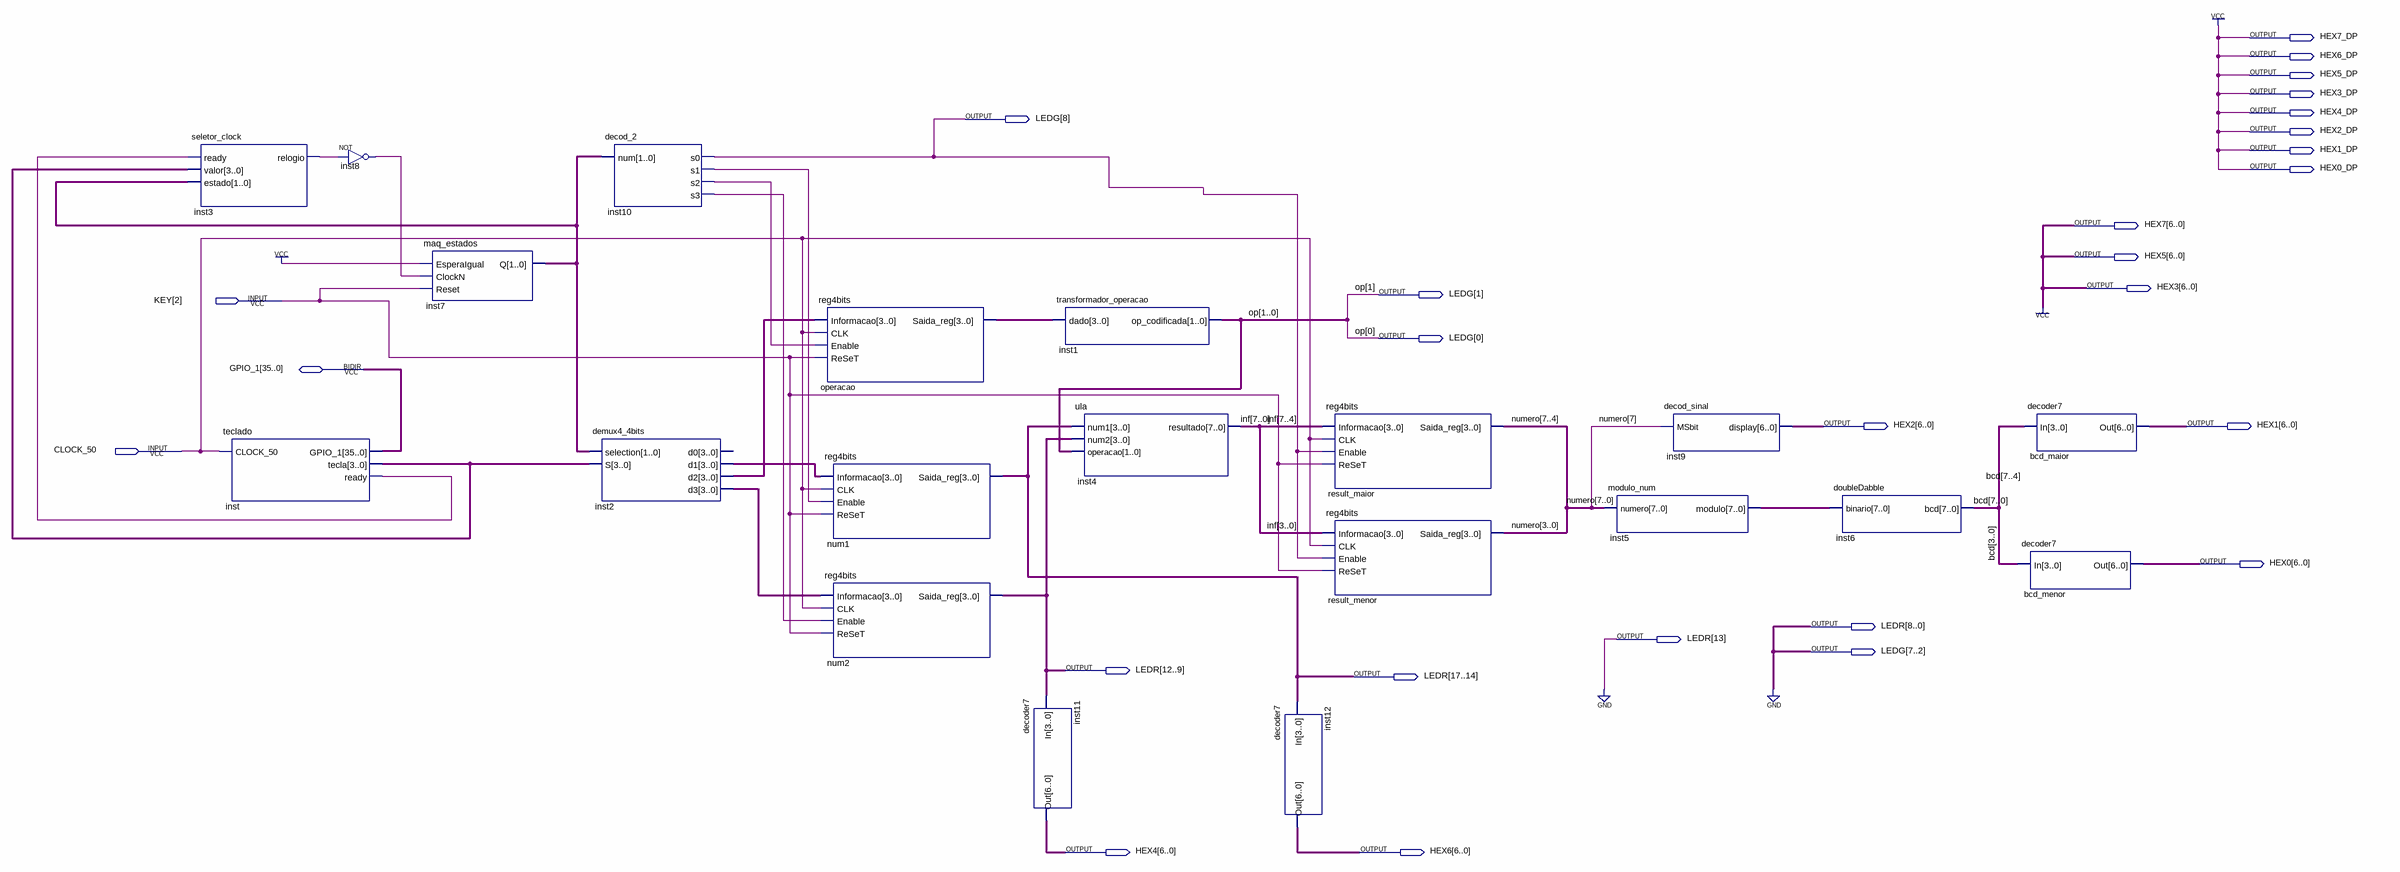
[diagram p0: schematic sheet]
// Quartus schematic CalculadoraDigital.bdf as structural Verilog: 20 symbols, 27 pins
module CalculadoraDigital (
  input  [2:2] KEY,
  input  CLOCK_50,
  inout  [35:0] GPIO_1,
  output HEX7_DP,
  output HEX6_DP,
  output HEX5_DP,
  output HEX3_DP,
  output HEX4_DP,
  output [8:0] LEDG,
  output HEX2_DP,
  output HEX1_DP,
  output HEX0_DP,
  output [6:0] HEX7,
  output [6:0] HEX5,
  output [6:0] HEX3,
  output [6:0] HEX2,
  output [6:0] HEX1,
  output [6:0] HEX0,
  output [17:0] LEDR,
  output [6:0] HEX4,
  output [6:0] HEX6
);

  wire inst3_relogio, inst8_out, inst10_s1, inst10_s2, inst10_s3, inst_ready;
  wire [1:0] inst7_q;
  wire [3:0] inst2_d1, inst2_d2, inst2_d3, inst_tecla, operacao_saida_reg;
  wire [7:0] bcd, inf, inst5_modulo, numero;

  seletor_clock inst3 (.ready(inst_ready), .valor(inst_tecla), .estado(inst7_q), .relogio(inst3_relogio));
  teclado inst (.CLOCK_50(CLOCK_50), .tecla(inst_tecla), .ready(inst_ready), .GPIO_1(GPIO_1));
  not inst8 (inst8_out, inst3_relogio);
  maq_estados inst7 (.EsperaIgual(1'b1), .ClockN(inst8_out), .Reset(KEY[2]), .Q(inst7_q));
  decod_2 inst10 (.num(inst7_q), .s0(LEDG[8]), .s1(inst10_s1), .s2(inst10_s2), .s3(inst10_s3));
  demux4_4bits inst2 (.selection(inst7_q), .S(inst_tecla), .d1(inst2_d1), .d2(inst2_d2), .d3(inst2_d3));  // open: d0
  reg4bits operacao (
    .Informacao(inst2_d2), .CLK(CLOCK_50), .Enable(inst10_s2), .ReSeT(KEY[2]), .Saida_reg(operacao_saida_reg));
  reg4bits num1 (.Informacao(inst2_d1), .CLK(CLOCK_50), .Enable(inst10_s1), .ReSeT(KEY[2]), .Saida_reg(LEDR[17:14]));
  reg4bits num2 (.Informacao(inst2_d3), .CLK(CLOCK_50), .Enable(inst10_s3), .ReSeT(KEY[2]), .Saida_reg(LEDR[12:9]));
  decoder7 inst11 (.In(LEDR[12:9]), .Out(HEX4));
  transformador_operacao inst1 (.dado(operacao_saida_reg), .op_codificada(LEDG[1:0]));
  ula inst4 (.num1(LEDR[17:14]), .num2(LEDR[12:9]), .operacao(LEDG[1:0]), .resultado(inf));
  decoder7 inst12 (.In(LEDR[17:14]), .Out(HEX6));
  reg4bits result_maior (
    .Informacao(inf[7:4]), .CLK(CLOCK_50), .Enable(LEDG[8]), .ReSeT(KEY[2]), .Saida_reg(numero[7:4]));
  reg4bits result_menor (
    .Informacao(inf[3:0]), .CLK(CLOCK_50), .Enable(LEDG[8]), .ReSeT(KEY[2]), .Saida_reg(numero[3:0]));
  modulo_num inst5 (.numero(numero), .modulo(inst5_modulo));
  decod_sinal inst9 (.MSbit(numero[7]), .display(HEX2));
  doubleDabble inst6 (.binario(inst5_modulo), .bcd(bcd));
  decoder7 bcd_maior (.In(bcd[7:4]), .Out(HEX1));
  decoder7 bcd_menor (.In(bcd[3:0]), .Out(HEX0));

  assign HEX0_DP = 1'b1;
  assign HEX1_DP = 1'b1;
  assign HEX2_DP = 1'b1;
  assign HEX3 = {7{1'b1}};
  assign HEX3_DP = 1'b1;
  assign HEX4_DP = 1'b1;
  assign HEX5 = {7{1'b1}};
  assign HEX5_DP = 1'b1;
  assign HEX6_DP = 1'b1;
  assign HEX7 = {7{1'b1}};
  assign HEX7_DP = 1'b1;
  assign {LEDR[13], LEDR[8:0]} = {10{1'b0}};

  // Other names for the same wires on the sheet: op[1:0] = LEDG[1:0]
endmodule
